# Altium schematic sheet Sheet2.SchDoc
size A4
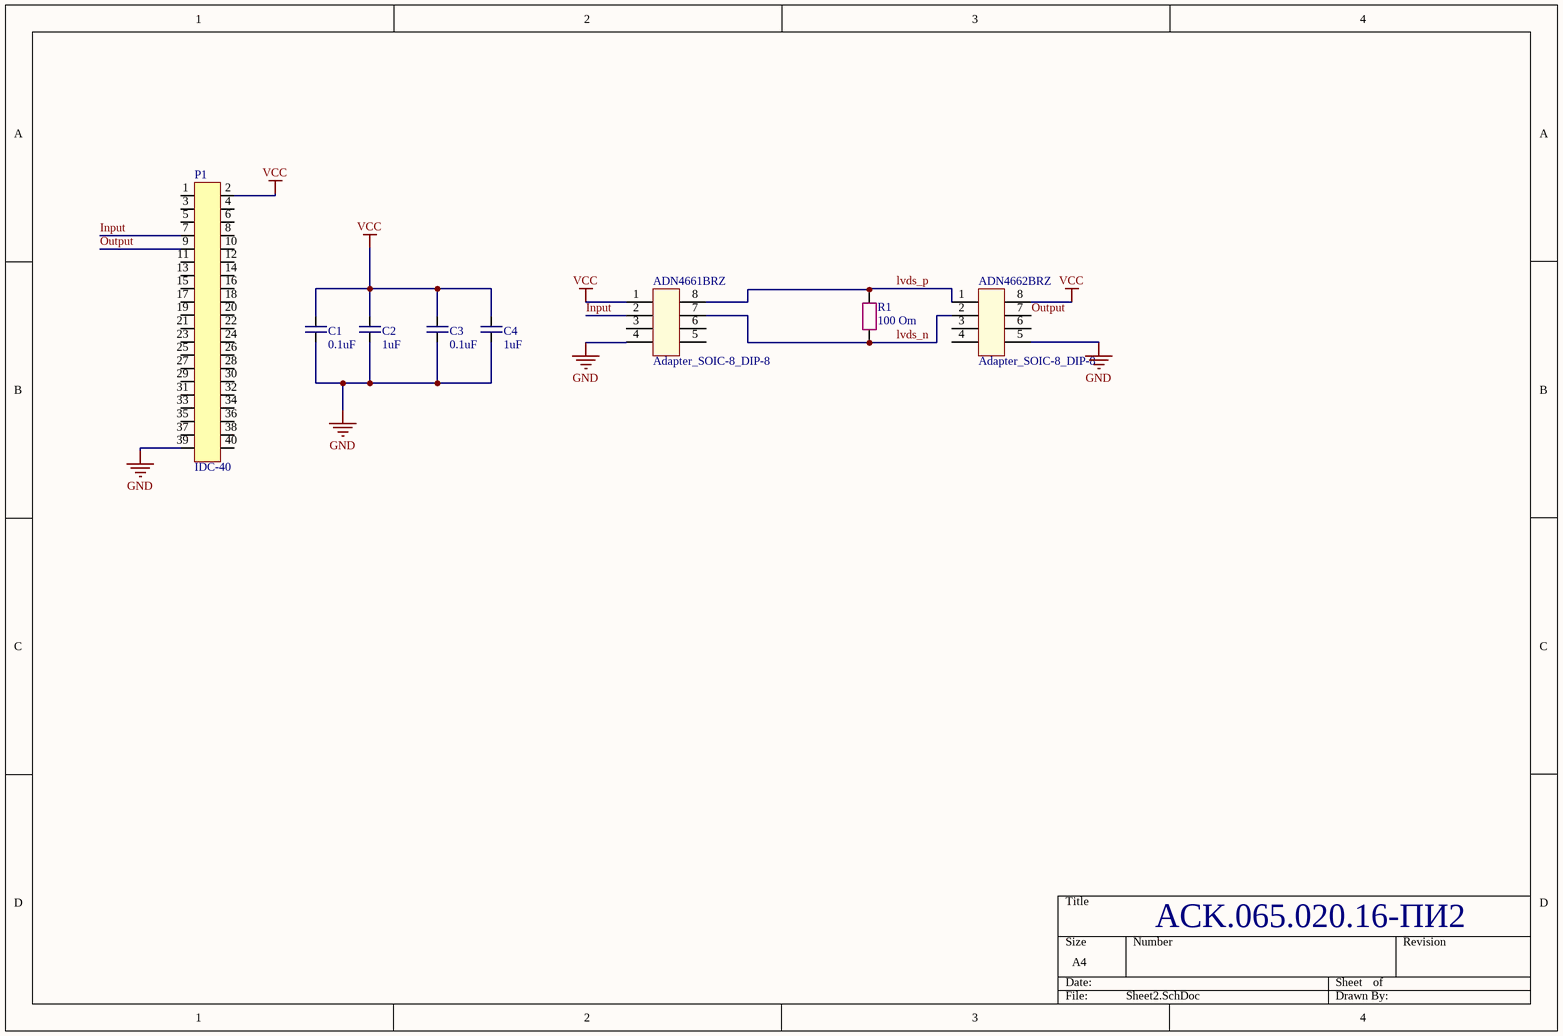
[diagram p0: Sheet2.SchDoc]

## Parts
ADN4661BRZ  Adapter_SOIC-8_DIP-8  [Adapter_TSSOP-16_DIP-16_pins1-8]
ADN4662BRZ  Adapter_SOIC-8_DIP-8  [Adapter_TSSOP-16_DIP-16_pins1-8]
C1  0.1uF  [C_0805]
C2  1uF  [C_0805]
C3  0.1uF  [C_0805]
C4  1uF  [C_0805]
P1  IDC-40  [IDC-40]
R1  100 Om  [R_0805]

## Nets
GND: ADN4661BRZ.4 ADN4662BRZ.5 C1.2 C2.2 C3.2 C4.2 P1.39
VCC: ADN4661BRZ.1 ADN4662BRZ.8 C1.1 C2.1 C3.1 C4.1 P1.2
Input: ADN4661BRZ.2 P1.7
lvds_n: ADN4661BRZ.7 ADN4662BRZ.2 R1.1
lvds_p: ADN4661BRZ.8 ADN4662BRZ.1 R1.2
Output: ADN4662BRZ.7 P1.9

Not connected (* = marked no-connect by the designer): ADN4661BRZ 3(37) 5(39) 6(40); ADN4662BRZ 3(37) 4(38) 6(40); P1 1(0) 3 4 5 6 8 10 11 12 13 14 15 16 17 18 19 20 21 22 23 24 25 26 27 28 29 30 31 32 33 34 35 36 37 38 40

## Notes on the sheet
- ACK.065.020.16-ПИ2

## Library data of the parts
C1-C4 = capacitor 0805
P1 = IDC-40: разъем 2529
R1 = resistor 0805